# Altium schematic sheet MM6108IQ MotherBoard.SchDoc
size A; SheetNumber: 1; SheetTotal: 4
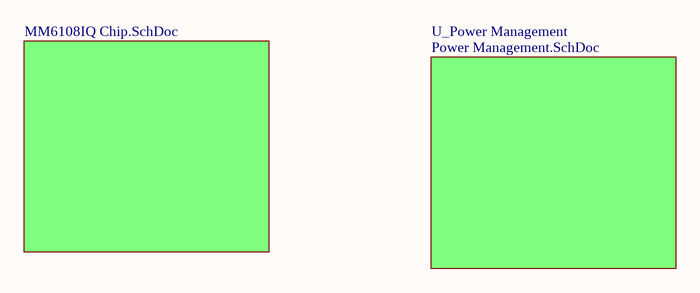
[diagram p0: MM6108IQ MotherBoard.SchDoc]

## Sub-sheets
U_MM6108IQ MotherBoard = MM6108IQ Chip.SchDoc: no entries
U_Power Management = Power Management.SchDoc: no entries